# EasyEDA Pro project EasyEDApro.epro, board Robo-EM-ESP32C6-no-uart
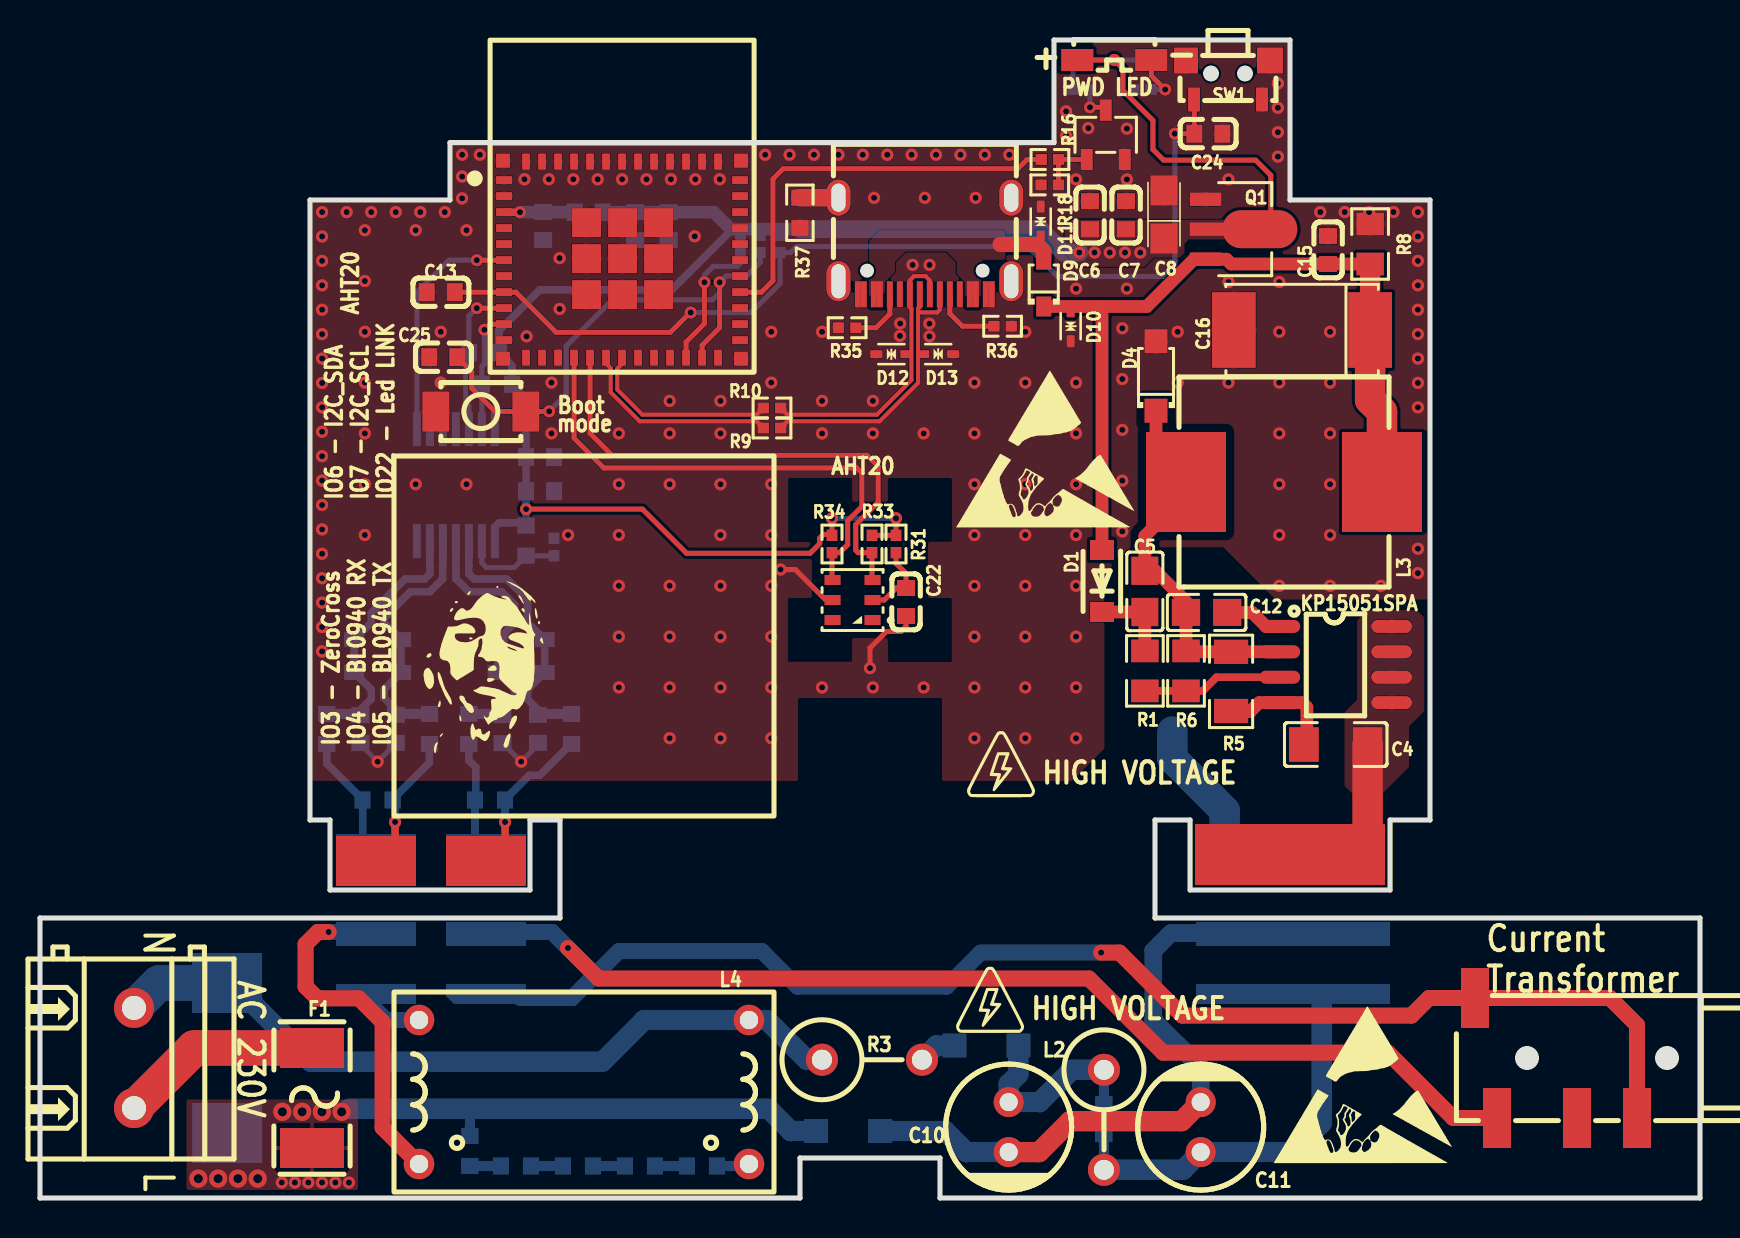
[diagram p1: board, top side]
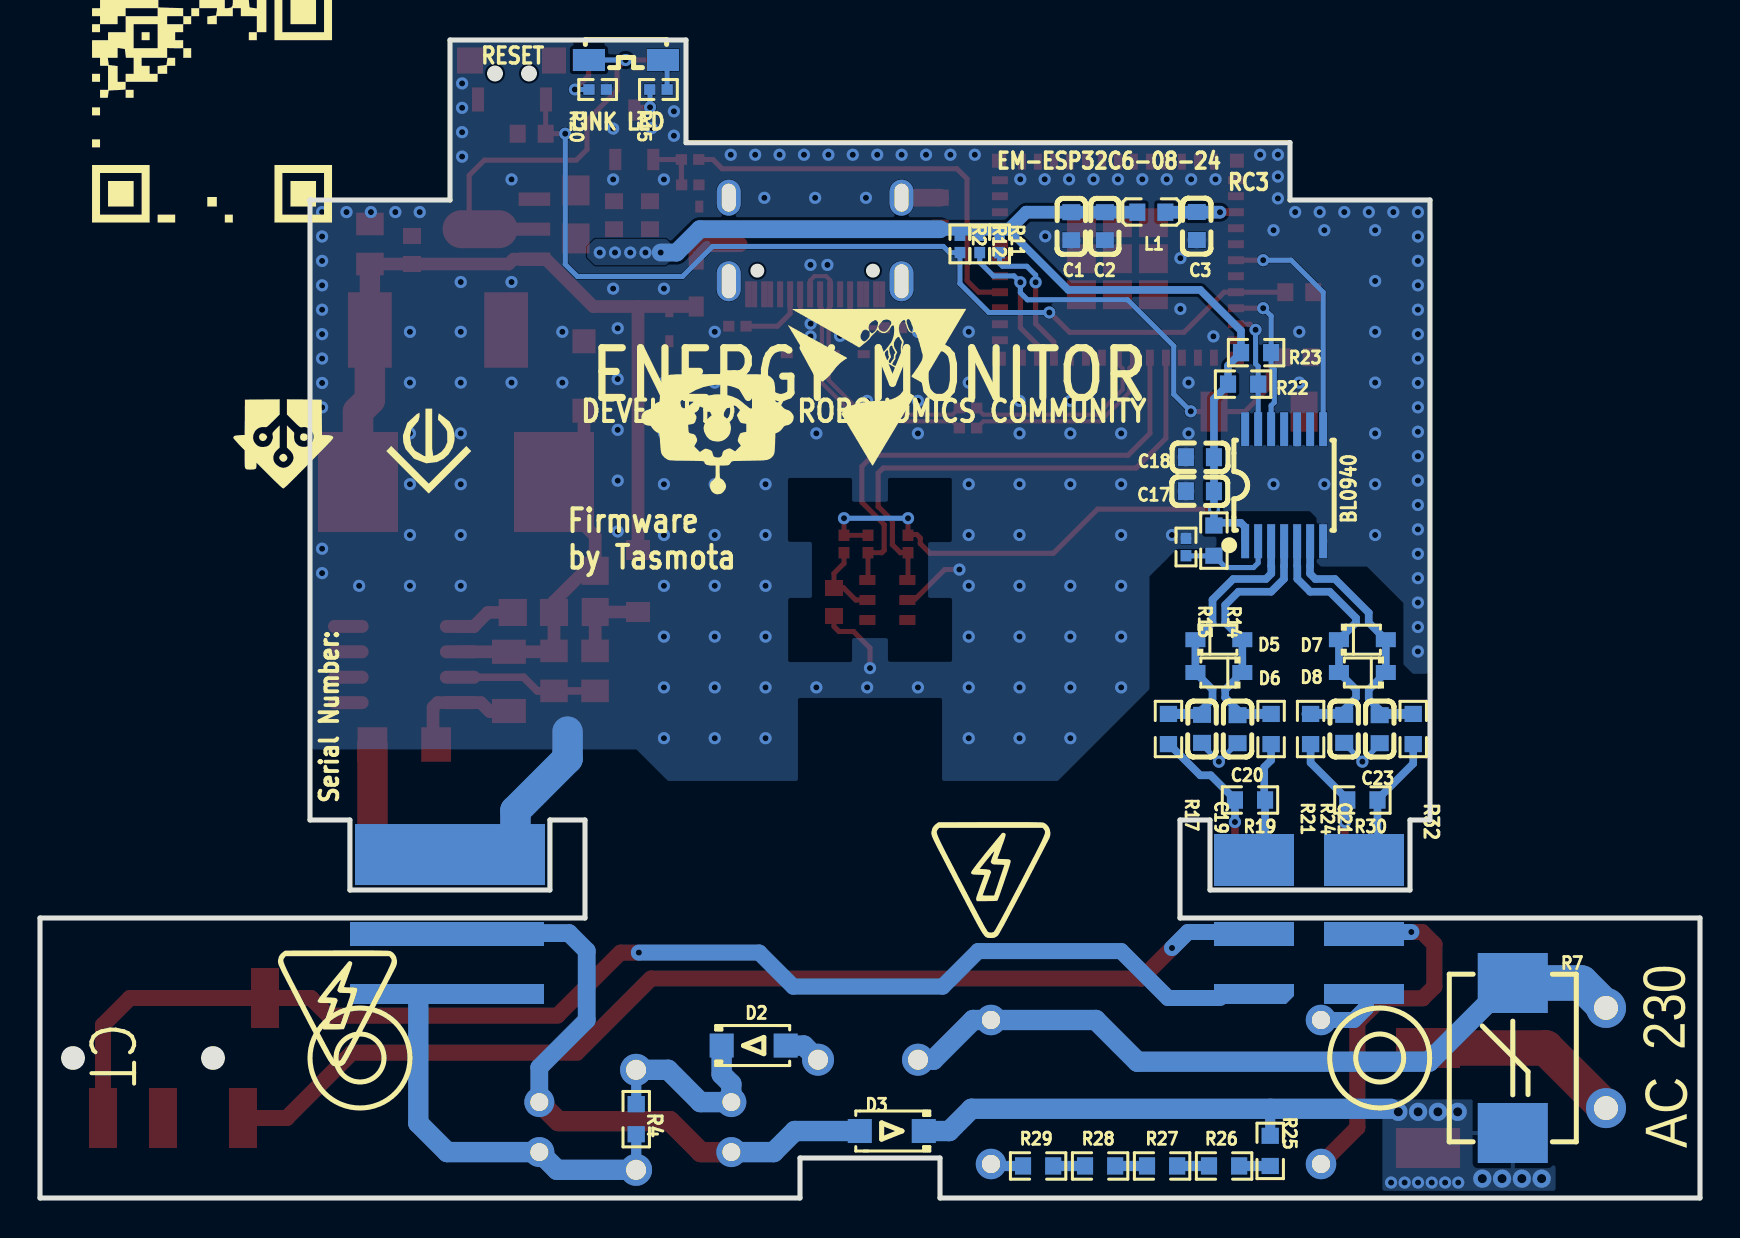
[diagram p2: board, bottom side, seen from below]

Outline 83 x 57.9 mm; copper layers: Top Layer, Bottom Layer. Coordinates in mm from the lower left corner of the outline.
Outline path: 0,14 26,14 26,18.9 24.5,18.9 24.5,15.4 14.5,15.4 14.5,18.9 13.5,18.9 13.5,49.9 20.5,49.9 20.5,52.77 50.7,52.77 50.7,57.9 62.5,57.9 62.5,49.9 69.5,49.9 69.5,18.9 67.5,18.9 67.5,15.4 57.5,15.4 57.5,18.9 55.75,18.9 55.75,14 83,14 83,0 45,0 45,2 38,2 38,0 0,0 0,14
Stack: Top Layer 0.035mm / Dielectric1 1.51mm FR4 er 4.5 / Bottom Layer 0.035mm

## Design rules (mm)
net USBDN: DP1
net USBDP: DP1
net IP1: DP_I
net IN1: DP_I
net VN: DP_V
net VP: DP_V
net EDN: DP2
net EDP: DP2
net IP2: DP_I1
net IN2: DP_I1
net VP1: DP_V1
net VN1: DP_V1
template: Custom Config
spacing copperThickness1oz (default): track to track 0.102, other pairs 0.152 to 0.3
spacing copperThickness2oz: track to track 0.203, other pairs 0.152 to 0.3
track width copperThickness1oz (default): min 0.127, default 0.254, max 2.54
track width copperThickness2oz: min 0.203, default 0.254, max 2.54
differential pair differentialPair (default): width min 0.127, default 0.254, max 2.54; gap min 0.152, default 0.152
differential pair differentialPair_USB: width min 0.208, default 0.208, max 0.208; gap min 0.127, default 0.127
differential pair differentialPair_EM: width min 0.381, default 0.381, max 2.54; gap min 0.254, default 0.254
via viaSize (default): diameter min 0.5, default 0.61, max 10; hole min 0.3, default 0.305, max 6.299
net GND uses copperRegion_USB
net VUSB uses copperRegion_VUSB
net USBDN uses copperRegion_USB, differentialPair_USB
net USBDP uses copperRegion_USB, differentialPair_USB
net +5V uses copperRegion_VUSB
net IP1 uses differentialPair_EM
net IN1 uses differentialPair_EM
net VN uses differentialPair_EM
net VP uses differentialPair_EM
net 3V3 uses copperRegion_VUSB
net $1N85419 uses copperRegion_VUSB
net EDN uses copperRegion_USB, differentialPair_USB
net EDP uses copperRegion_USB, differentialPair_USB
net IP2 uses differentialPair_EM
net IN2 uses differentialPair_EM
net VP1 uses differentialPair_EM
net VN1 uses differentialPair_EM
net PWM uses copperRegion_PWM
diff pair DP1 uses differentialPair_USB
diff pair DP_I uses differentialPair_EM
diff pair DP_V uses differentialPair_EM
diff pair DP2 uses differentialPair_USB
diff pair DP_I1 uses differentialPair_EM
diff pair DP_V1 uses differentialPair_EM
['net', 'edp'] ['NET', 'EDN'] uses copperRegion_USB
['net', 'usbdp'] ['NET', 'USBDN'] uses copperRegion_USB

## Placement (name value [footprint] x y rotation side)
C1  10uF  [C0603]  31.43 48.59 90 bottom
C2  100nF  [C0603]  29.76 48.59 90 bottom
C3  100nF  [C0603]  25.16 48.6 90 bottom
C4  100pF  [C1206]  64.79 22.67 0 top
C5  1uF  [C0805]  55.24 30.33 270 top
C6  22nF  [C0603]  52.5 49.14 270 top
C7  1uF  [C0603]  54.3 49.14 270 top
C8  22uF  [CASE-A_3216]  56.2 49.18 90 top
C10  2.2uF  [CAP-TH_BD6.3-P2.50-D0.5-FD]  48.43 3.55 270 top
C11  2.2uF  [CAP-TH_BD6.3-P2.50-D0.5-FD]  58.03 3.55 90 top
C12  1uF  [C0805]  58.33 29.28 0 top
C13  1uF  [C0603]  20.04 45.29 180 top
C15  10uF  [C0603]  64.4 47.4 270 top
C16  680uF  [CAP-SMD_L7.3-W4.3]  63.1 43.4 0 top
C17  10uF  [C0603]  25 35.34 180 bottom
C18  100nF  [C0603]  25 37.04 0 bottom
C19  33nF  [C0603]  24.9 23.46 90 bottom
C20  33nF  [C0603]  23.12 23.44 270 bottom
C21  33nF  [C0603]  17.79 23.46 90 bottom
C22  10uF  [C0603]  43.3 29.8 270 top
C23  33nF  [C0603]  16.02 23.44 270 bottom
C24  100nF  [C0603]  58.42 53.22 0 top
C25  100nF  [C0603]  20.16 42.04 180 top
CN1  PJ-320D  [AUDIO-SMD_PJ-320D]  75.8 7 270 top
D1  FR107W  [SOD-123F_L2.8-W1.8-LS3.7-RD]  53.1 30.85 90 top
D2  1N4007  [SOD-123FL_L2.8-W1.8-LS3.7-RD]  47.32 7.62 180 bottom
D3  1N4007  [SOD-123FL_L2.8-W1.8-LS3.7-RD]  40.41 3.35 0 bottom
D4  E1J  [SOD-123FL_L2.7-W1.8-LS3.7-RD]  55.8 41.1 90 top
D5  1N4148WS  [SOD-323_L1.8-W1.3-LS2.5-RD]  24.06 27.92 180 bottom
D6  1N4148WS  [SOD-323_L1.8-W1.3-LS2.5-RD]  24.06 26.28 0 bottom
D7  1N4148WS  [SOD-323_L1.8-W1.3-LS2.5-RD]  16.88 27.92 180 bottom
D8  1N4148WS  [SOD-323_L1.8-W1.3-LS2.5-RD]  16.88 26.28 0 bottom
D9  -  [SOD-323_L1.8-W1.3-LS2.5-RD]  50.19 45.75 90 top
D10  LESD5D5.0CT1G-ES  [SOD-523_L1.2-W0.8-LS1.6-BI]  51.53 43.59 90 top
D11  LESD5D5.0CT1G-ES  [SOD-523_L1.2-W0.8-LS1.6-BI]  50.03 48.82 270 top
D12  LESD5D5.0CT1G-ES  [SOD-523_L1.2-W0.8-LS1.6-BI]  42.57 42.19 0 top
D13  LESD5D5.0CT1G-ES  [SOD-523_L1.2-W0.8-LS1.6-BI]  44.91 42.19 180 top
F1  JFC2410-1200FS  [F2410]  13.6 5 90 top
L1  2nH  [L0603]  27.43 49.29 180 bottom
L2  220uH  [IND-TH_BD4.0-P5.00-D0.8]  53.2 3.91 270 top
L3  560uH  [IND-SMD_L10.5-W10.5]  62.2 35.8 0 top
L4  HPT225A-G  [XFMR-TH_4P-L19.0-10.0-P7.20]  27.2 5.3 180 top
LED1  XL-4008UGC  [LED-SMD_L4.0-W1.4-RD_GREEN]  53.7 56.9 0 bottom
NOREF  -  [Pad_e19800]  62.5 17.17 0 top
NOREF#2  -  [Pad_e19812]  62.65 13.2 0 top
NOREF#3  -  [Pad_e19813]  62.65 10.2 0 top
NOREF#4  -  [Pad_e19808]  16.8 13.2 0 top
NOREF#5  -  [Pad_e19809]  22.3 13.2 0 top
NOREF#6  -  [Pad_e19803]  16.8 16.9 0 top
NOREF#7  -  [Pad_e19810]  16.8 10.2 0 top
NOREF#8  -  [Pad_e19806]  16.8 16.85 0 top
NOREF#9  -  [Pad_e19802]  22.3 16.9 0 top
NOREF#10  -  [Pad_e19807]  22.3 16.85 0 top
NOREF#11  -  [Pad_e19811]  22.3 10.2 0 top
NOREF#12  -  [Pad_e19801]  62.5 17.17 0 top
P1  WJ128V-5.0-2P  [CONN-TH_2P-P5.00_WJ128V-5.0-2P]  4.7 7 270 top
Q1  AMS1117-3.3V  [SOT-89-3_L4.5-W2.5-P1.50-LS4.2-BR]  59.64 48.44 180 top
Q2  SS8050  [SOT-23-3_L2.9-W1.6-P1.90-LS2.8-BR]  53.29 53.16 270 top
R1  39kΩ  [R0805]  55.25 26.36 90 top
R2  10kΩ  [R0402]  37 47.7 90 bottom
R3  100Ω  [IND-TH_BD4.0-P5.00-D0.8]  41.6 6.91 0 top
R4  4.7kΩ  [R0603]  53.19 3.94 270 bottom
R5  510mΩ  [R1206]  59.55 25.83 90 top
R6  20kΩ  [R0805]  57.3 26.36 270 top
R7  07D471K68RV0149  [RES-SMD_L8.2-W6.3]  9.36 7 90 bottom
R8  10kΩ  [R0805]  66.51 47.7 270 top
R9  22Ω  [R0402]  36.6 38.5 180 top
R10  22Ω  [R0402]  36.6 39.5 180 top
R11  3.3kΩ  [R0402]  35.02 47.7 270 bottom
R12  10kΩ  [R0402]  36.01 47.7 90 bottom
R13  10kΩ  [R0402]  25.7 32.55 270 bottom
R14  CMFA103J3950HANT  [R0603]  24.3 32.87 90 bottom
R15  1kΩ  [R0402]  52.08 55.43 180 bottom
R16  1kΩ  [R0402]  50.5 51.92 0 top
R17  1kΩ  [R0603]  26.58 23.45 90 bottom
R18  10kΩ  [R0402]  50.49 50.65 0 top
R19  1Ω  [R0603]  22.5 19.9 0 bottom
R20  1kΩ  [R0402]  55.12 55.43 0 bottom
R21  1kΩ  [R0603]  21.44 23.45 90 bottom
R22  4.7kΩ  [R0603]  22.85 40.69 180 bottom
R23  4.7kΩ  [R0603]  22.2 42.27 180 bottom
R24  1kΩ  [R0603]  19.47 23.45 90 bottom
R25  20kΩ  [R0603]  21.49 2.35 270 bottom
R26  20kΩ  [R0603]  23.8 1.6 0 bottom
R27  20kΩ  [R0603]  26.9 1.6 0 bottom
R28  20kΩ  [R0603]  30 1.6 0 bottom
R29  20kΩ  [R0603]  33.09 1.6 0 bottom
R30  22Ω  [R0603]  16.88 19.9 0 bottom
R31  390Ω  [R0402]  42.8 32.7 270 top
R32  1kΩ  [R0603]  14.34 23.45 90 bottom
R33  4.7kΩ  [R0402]  41.6 32.7 270 top
R34  4.7kΩ  [R0402]  39.6 32.7 270 top
R35  5.1kΩ  [R0402]  40.36 43.51 0 top
R36  5.1kΩ  [R0402]  48.13 43.59 180 top
R37  1MΩ  [R0603]  38 49.26 90 top
SW1  TS-1010-C-A  [key-smd_tx-1010-x-x]  59.4 55.9 0 top
SW2  -  [SW-SMD_L3.9-W2.9-P4.15-LS5.0]  22.04 39.32 0 top
U1  ESP32-C6-MINI-1-N4  [WIFIM-SMD_61P-L16.6-W13.2-P0.80-ESP32-C6-MINI-1-N4]  29.1 46.92 0 top
U2  KP15051SPA  [SOP-8_L4.9-W3.8-P1.27-LS6.0-BL]  64.79 26.67 270 top
U3  BL0940  [TSSOP-14_L5.0-W4.4-P0.65-LS6.4-BL]  20.79 35.64 180 bottom
U4  XL-4008SURC  [LED-SMD_L4.0-W1.4-FD_C9900036310]  53.72 56.9 0 top
U5  AHT20  [SENSOR-SMD_L3.0-W3.0-P1.00-BR]  40.63 29.9 0 top
USB1  KH-TYPE-C-16P  [USB-C-SMD_KH-TYPE-C-16P]  44.24 47.6 180 top

## Footprints (pads in the part's own frame, mm; a bottom-side part is the same pattern mirrored in y, then rotated)
AUDIO-SMD_PJ-320D
  rect 3x1.4 smd: 1(-3,-4.05) 2(3,4.05) 3(3,1.05) 4(3,-2.95)
C0603
  rect 0.8x0.9 smd: 1(-0.7,0) 2(0.7,0)
C0805
  rect 1.41x1.35 smd: 1(-1.03,0) 2(1.03,0)
C1206
  rect 1.485x1.728 smd: 1(-1.593,0) 2(1.593,0)
CAP-SMD_L7.3-W4.3
  rect 2.185x3.78 smd: 1(3.406,0) 2(-3.406,0)
CAP-TH_BD6.3-P2.50-D0.5-FD
  round 1.5 hole 0.9: 1(-1.25,0) 2(1.25,0)
CASE-A_3216
  rect 1.5x1.359 smd: 1(-1.2,0) 2(1.2,0)
CONN-TH_2P-P5.00_WJ128V-5.0-2P
  round 2 hole 1.2: 1(-2.505,0) 2(2.505,0)
F2410
  rect 2x3.2 smd: 1(-2.5,0) 2(2.5,0)
IND-SMD_L10.5-W10.5
  rect 4x5 smd: 1(-4.9,0) 2(4.9,0)
IND-TH_BD4.0-P5.00-D0.8
  round 1.6 hole 1: 1(-2.5,0) 2(2.5,0)
key-smd_tx-1010-x-x
  rect 0.6x1.2 smd: 1(-1.7,-0.975) 2(1.7,-0.975)
  rect 1.2x1.3 smd: 3(-2.1,0.975)
  rect 1.3x1.3 smd: 4(2.1,0.975)
L0603
  rect 0.8x0.864 smd: 1(-0.7,0) 2(0.7,0)
LED-SMD_L4.0-W1.4-FD_C9900036310
  rect 1.6x1.1 smd: 1(-1.85,0) 2(1.85,0)
LED-SMD_L4.0-W1.4-RD_GREEN
  rect 1.6x1.1 smd: 1(-1.85,0) 2(1.85,0)
Pad_e19800
  rect 9.5x3.05 smd: 2(0,0)
Pad_e19801
  rect 9.5x3.05 smd far side: 2(0,0)
Pad_e19802
  rect 4x2.6 smd far side: 2(0,0)
Pad_e19803
  rect 4x2.6 smd far side: 2(0,0)
Pad_e19806
  rect 4x2.5 smd: 2(0,0)
Pad_e19807
  rect 4x2.5 smd: 2(0,0)
Pad_e19808
  rect 4x1.2 smd far side: 2(0,0)
Pad_e19809
  rect 4x1.2 smd far side: 2(0,0)
Pad_e19810
  rect 4x1 smd far side: 2(0,0)
Pad_e19811
  custom 4x1 smd far side: 54(0,0)
Pad_e19812
  rect 9.7x1.2 smd far side: 2(0,0)
Pad_e19813
  rect 9.7x1 smd far side: 2(0,0)
R0402
  rect 0.566x0.54 smd: 1(-0.433,0) 2(0.433,0)
R0603
  rect 0.806x0.864 smd: 1(-0.753,0) 2(0.753,0)
R0805
  rect 1.133x1.377 smd: 1(-1,0) 2(1,0)
R1206
  rect 1.208x1.701 smd: 1(-1.479,0) 2(1.479,0)
RES-SMD_L8.2-W6.3
  rect 3x3.5 smd: 1(-3.75,0) 2(3.75,0)
SENSOR-SMD_L3.0-W3.0-P1.00-BR
  rect 0.8x0.5 smd: 1(1,-1) 2(1,0) 3(1,1) 4(-1,1) 5(-1,0) 6(-1,-1)
SOD-123F_L2.8-W1.8-LS3.7-RD
  rect 1x1.2 smd: 1(-1.55,0) 2(1.55,0)
SOD-123FL_L2.7-W1.8-LS3.7-RD
  rect 1.2x1.15 smd: 1(-1.735,0) 2(1.735,0)
SOD-123FL_L2.8-W1.8-LS3.7-RD
  rect 1.2x1.2 smd: 1(-1.6,0) 2(1.6,0)
SOD-323_L1.8-W1.3-LS2.5-RD
  rect 1x0.75 smd: 1(-1.173,0) 2(1.173,0)
SOD-523_L1.2-W0.8-LS1.6-BI
  rect 0.6x0.4 smd: 1(-0.75,0) 2(0.75,0)
SOP-8_L4.9-W3.8-P1.27-LS6.0-BL
  oval 0.65x2.032 smd: 1(-1.905,-2.796) 2(-0.635,-2.796) 3(0.635,-2.796) 4(1.905,-2.796) 5(1.905,2.796) 6(0.635,2.796) 7(-0.635,2.796) 8(-1.905,2.796)
SOT-23-3_L2.9-W1.6-P1.90-LS2.8-BR
  rect 1.07x0.6 smd: 1(1.235,-0.95) 2(1.235,0.95) 3(-1.235,0)
SOT-89-3_L4.5-W2.5-P1.50-LS4.2-BR
  rect 1.575x0.672 smd: 1(1.356,-1.5) 3(1.356,1.5)
  custom 5.377x1.9 smd: 2(-1.356,0)
SW-SMD_L3.9-W2.9-P4.15-LS5.0
  rect 1.35x2 smd: 1(-2.25,0) 2(2.25,0)
TSSOP-14_L5.0-W4.4-P0.65-LS6.4-BL
  rect 0.4x1.7 smd: 1(-1.95,-2.8) 2(-1.3,-2.8) 3(-0.65,-2.8) 4(0,-2.8) 5(0.65,-2.8) 6(1.3,-2.8) 7(1.95,-2.8) 8(1.95,2.8) 9(1.3,2.8) 10(0.65,2.8) 11(0,2.8) 12(-0.65,2.8) 13(-1.3,2.8) 14(-1.95,2.8)
USB-C-SMD_KH-TYPE-C-16P
  oval 1.2x2 hole 0.7x1.7: 1(-4.32,1.765) 2(4.32,1.765)
  oval 1.2x1.8 hole 0.7x1.4: 3(-4.32,-2.415) 4(4.32,-2.415)
  rect 0.3x1.3 smd: A1(-3.35,2.415) A4(-2.55,2.415) A5(-1.25,2.415) A6(-0.25,2.415) A7(0.25,2.415) A8(1.25,2.415) A9(2.55,2.415) A12(3.35,2.415) B1(3.05,2.415) B4(2.25,2.415) B5(1.75,2.415) B6(0.75,2.415) B7(-0.75,2.415) B8(-1.75,2.415) B9(-2.25,2.415) B12(-3.05,2.415)
WIFIM-SMD_61P-L16.6-W13.2-P0.80-ESP32-C6-MINI-1-N4
  rect 0.8x0.4 smd: 1(-5.9,3.975) 2(-5.9,3.175) 3(-5.9,2.375) 4(-5.9,1.575) 5(-5.9,0.775) 6(-5.9,-0.025) 7(-5.9,-0.825) 8(-5.9,-1.625) 9(-5.9,-2.425) 10(-5.9,-3.225) 11(-5.9,-4.025) 25(5.9,-4.025) 26(5.9,-3.225) 27(5.9,-2.425) 28(5.9,-1.625) 29(5.9,-0.825) 30(5.9,-0.025) 31(5.9,0.775) 32(5.9,1.575) 33(5.9,2.375) 34(5.9,3.175) 35(5.9,3.975)
  rect 0.4x0.8 smd: 12(-4.8,-4.9) 13(-4,-4.9) 14(-3.2,-4.9) 15(-2.4,-4.9) 16(-1.6,-4.9) 17(-0.8,-4.9) 18(0,-4.9) 19(0.8,-4.9) 20(1.6,-4.9) 21(2.4,-4.9) 22(3.2,-4.9) 23(4,-4.9) 24(4.8,-4.9) 36(4.8,4.9) 37(4,4.9) 38(3.2,4.9) 39(2.4,4.9) 40(1.6,4.9) 41(0.8,4.9) 42(0,4.9) 43(-0.8,4.9) 44(-1.6,4.9) 45(-2.4,4.9) 46(-3.2,4.9) 47(-4,4.9) 48(-4.8,4.9)
  rect 1.45x1.45 smd: 49(-1.775,1.85) 49(-1.775,0.05) 49(-1.775,-1.75) 49(0.025,1.85) 49(0.025,0.05) 49(0.025,-1.75) 49(1.825,1.85) 49(1.825,0.05) 49(1.825,-1.75)
  rect 0.7x0.7 smd: 50(5.95,4.95) 51(5.95,-4.95) 52(-5.95,-4.95) 53(-5.95,4.95)
XFMR-TH_4P-L19.0-10.0-P7.20
  round 1.524 hole 0.914: 1(-8.25,3.6) 2(-8.25,-3.6) 3(8.25,3.6) 4(8.25,-3.6)

## Nets
As in the schematic, except:
GND: C1.1 C2.1 C3.1 C6.1 C7.1 C8.2 C10.2 C11.2 C13.2 C15.1 C16.2 C17.1 C18.2 C19.1 C20.2 C21.1 C22.2 C23.2 C24.2 C25.2 D3.2 D4.2 D10.1 D11.1 D12.1 D13.1 NOREF#2.2 NOREF#12.2 Q1.1 Q2.2 R8.1 R13.1 R18.1 R20.1 R35.1 R36.1 R37.1 SW1.2 SW1.3 SW1.4 SW2.1 U1.1 U1.2 U1.11 U1.14 U1.36 U1.37 U1.38 U1.39 U1.40 U1.41 U1.42 U1.43 U1.44 U1.45 U1.46 U1.47 U1.48 U1.49 U1.50 U1.51 U1.52 U1.53 U3.7 U3.10 U5.5 USB1.A1 USB1.A12 USB1.B1 USB1.B12
DRAIN: C4.2 C11.1 L2.2 NOREF.2 NOREF#3.2 R4.2 U2.5 U2.6 U2.7 U2.8
IN1: CN1.4 NOREF#5.2 NOREF#9.2 R19.1 R21.1
IP1: CN1.1 CN1.2 NOREF#10.2 NOREF#11.54 R17.1 R19.2
VN: L4.3 NOREF#4.2 NOREF#6.2 R30.1 R32.1
VP: L4.4 NOREF#7.2 NOREF#8.2 R24.1 R30.2

Pads without a net: CN1 3; U1 4 5 7 13 19 20 21 24 25 26 27 29 32 33 34 35; U3 11 14; U5 1 6; USB1 A8 B8

## Via types
v1: diameter 0.61, hole 0.305, Top Layer to Bottom Layer, 226 vias
v2: diameter 0.914, hole 0.457, Top Layer to Bottom Layer, 8 vias

## Routing (per net, layer and track width the routed paths; a pad name or vN(x,y) marks a point on that pad's centre or on a via; arc(x,y) is an arc through that point)
3V3: length 92.3
  Top Layer w0.254: v1(24.3,34.45) 30.12,34.45 32.33,32.23 38.5,32.23 38.99,32.72 38.99,33 39.16,33.18 39.56,33.18 R34.1 v1(39.6,33.99) ; Q1.2 61.54,48.99 61.54,51.13 60.78,51.89 56.18,51.89 55.65,52.43 55.65,53.88 54.15,55.37 54.15,56.47 v1(53.72,56.9) U4.1 ; v1(42.8,33.99) R31.1 R33.1
  Bottom Layer w0.254: v1(53.72,56.9) LED1.2 ; v1(39.6,33.99) v1(42.8,33.99)
  Bottom Layer w0.381: U3.1 22.74,33.54 22.96,33.76 24.17,33.76 R14.2 v1(24.3,34.45) C17.2 C18.1 24.3,39.96 23.6,40.66 R22.1 23.6,41.62 R23.1 22.95,43.37 24.99,45.41 31.58,45.41 34.54,48.36 34.54,48.44
  Bottom Layer w0.635: L1.1 C2.2 C1.2 33.69,49.29 34.54,48.44 38,48.44
  Bottom Layer w0.889: v1(51.97,47.27) 51.18,47.27 50.01,48.44 38,48.44
  vias: v1(52.73,47.27) v1(53.49,47.27) v1(54.25,47.27) v1(55.01,47.27)
+5V: length 40.7
  Top Layer w0.635: 53.07,44.58 53.1,44.55 53.1,32.42 ; 53.07,44.58 55.34,44.58 57.7,46.94 Q1.3 59.32,46.94 59.56,46.7 C15.2 R8.2 ; 53.07,44.58 D9.1
  Top Layer w1.016: C16.1 R8.2
  Top Layer w1.524: C16.1 66.51,39.91 67.1,39.32 L3.2
GND: length 48.5
  Top Layer w0.254: U5.5 39.58,29.95 39.24,29.95 37.77,31.42 v1(37.03,31.42) ; C22.2 43.3,28.57 43.05,28.33 42.32,28.33 41.5,27.5 v1(41.5,26.49)
  Top Layer w1.016: C11.2 57.08,3.84 51.5,3.84 49.96,2.3 C10.2
  Bottom Layer w0.254: C23.2 16.02,22.68 v1(16.88,21.82) 17.79,22.73 C21.1 ; C20.2 23.13,22.74 v1(24.06,21.82) 24.9,22.66 C19.1
  Bottom Layer w0.889: 58.34,13.24 56.55,13.24 55.67,12.36 55.67,8.9 58.03,6.53 C11.2
  Bottom Layer w1.016: C10.2 46.32,2.3 45.26,3.35 D3.2
  Bottom Layer w1.524: 56.62,23.32 56.62,21.97 59.23,19.37 59.23,17.22
  vias: v1(14.1,49.3) v1(14.1,48.08) v1(14.1,46.85) v1(14.1,45.63) v1(14.1,44.41) v1(14.1,43.19) v1(14.1,41.97) v1(14.1,40.75) v1(14.1,39.53) v1(14.1,38.31) v1(14.1,37.09) v1(14.1,35.87) v1(14.1,34.65) v1(14.1,33.43) v1(14.1,32.21) v1(14.1,30.99) v1(14.1,29.77) v1(14.1,28.55) v1(14.1,27.33) v1(15.33,49.3) v1(16.24,48.39) v1(16.24,45.85) v1(16.24,43.31) v1(16.24,40.77) v1(16.24,38.23) v1(16.24,35.69) v1(16.24,33.15) v1(16.56,49.3) v1(17.79,49.3) v1(18.78,48.39) v1(18.78,35.69) v1(19.01,49.3) v1(20.04,43.31) v1(20.04,40.77) v1(20.24,49.3) v1(21.1,52.16) v1(21.1,51.07) v1(21.1,49.98) v1(21.32,48.39) v1(21.32,35.69) v1(21.99,52.16) v1(24.22,50.94) v1(24.33,43.08) v1(25.44,50.94) v1(25.57,40.77) v1(25.57,38.23) v1(25.98,46.99) v1(25.98,44.45) v1(26.4,33.15) v1(26.66,50.94) v1(27.88,50.94) v1(28.94,38.23) v1(28.94,35.69) v1(28.94,33.15) v1(28.94,30.61) v1(28.94,28.07) v1(28.94,25.53) v1(29.1,50.94) v1(30.32,50.94) v1(31.55,50.94) v1(31.48,39.86) v1(31.48,38.23) v1(31.48,35.69) v1(31.48,30.61) v1(31.48,28.07) v1(31.48,25.53) v1(31.48,22.99) v1(32.74,48.08) v1(32.77,50.94) v1(33.99,50.94) v1(34.02,39.86) v1(34.02,38.23) v1(34.02,35.69) v1(34.02,33.15) v1(34.02,30.61) v1(34.02,28.07) v1(34.02,25.53) v1(34.02,22.99) v1(36.26,52.16) v1(36.56,43.31) v1(36.56,40.77) v1(36.56,35.69) v1(36.56,33.15) v1(36.56,30.61) v1(36.56,28.07) v1(36.56,25.53) v1(36.56,22.99) v1(37.48,52.16) v1(38.7,52.16) v1(39.1,43.31) v1(39.1,39.86) v1(39.1,38.23) v1(39.1,25.53) v1(39.92,52.16) v1(41.14,52.16) v1(41.64,39.86) v1(41.64,38.23) v1(41.64,25.53) v1(41.7,50.01) v1(42.36,52.16) v1(43.01,43.73) v1(43,43.11) v1(43.58,52.16) v1(43.63,46.66) v1(44.24,50.01) v1(44.18,38.23) v1(44.18,25.53) v1(44.48,46.66) v1(44.47,43.72) v1(44.47,43.08) v1(44.8,52.16) v1(46.02,52.16) v1(46.72,40.77) v1(46.72,38.23) v1(46.72,35.69) v1(46.72,33.15) v1(46.72,30.61) v1(46.72,28.07) v1(46.72,25.53) v1(46.72,22.99) v1(46.78,50.01) v1(47.24,52.16) v1(48.46,52.16) v1(49.26,43.31) v1(49.26,40.77) v1(49.26,38.23) v1(49.26,35.69) v1(49.26,33.15) v1(49.26,30.61) v1(49.26,28.07) v1(49.26,25.53) v1(49.26,22.99) v1(51.3,54.33) v1(51.3,53.11) v1(51.8,50.93) v1(51.8,45.47) v1(51.8,40.77) v1(51.8,38.23) v1(51.8,35.69) v1(51.8,33.15) v1(51.8,30.61) v1(51.8,28.07) v1(51.8,25.53) v1(51.8,22.99) v1(52.41,53.5) v1(54.11,43.49) v1(54.11,40.95) v1(54.11,38.41) v1(54.11,35.87) v1(54.11,33.33) v1(54.34,53.47) v1(54.34,50.93) v1(54.34,45.47) v1(56.88,43.31) v1(56.88,40.77) v1(59.42,50.93) v1(59.42,45.8) v1(59.42,40.77) v1(61.9,55.73) v1(61.9,54.51) v1(61.9,53.29) v1(61.9,52.07) v1(61.96,45.8) v1(61.96,43.31) v1(61.96,40.77) v1(61.96,38.23) v1(61.96,35.69) v1(61.96,33.15) v1(61.96,30.61) v1(64.01,49.3) v1(64.5,43.31) v1(64.5,40.77) v1(64.5,38.23) v1(64.5,35.69) v1(64.5,33.15) v1(64.5,30.61) v1(65.23,49.3) v1(66.45,49.3) v1(67.04,30.61) v1(67.68,49.3) v1(68.9,49.3) v1(68.9,48.08) v1(68.9,46.85) v1(68.9,45.63) v1(68.9,44.41) v1(68.9,43.19) v1(68.9,41.97) v1(68.9,40.75) v1(68.9,39.53) v1(68.9,32.46) v1(68.9,31.24)
BL0940_RX: length 7.7
  Top Layer w0.254: v1(21.84,44.49) U1.9
  Bottom Layer w0.254: U3.12 21.44,39.62 21.28,39.78 21.28,41.42 21.44,41.58 R23.2 21.44,44.11 21.83,44.49 v1(21.84,44.49)
BL0940_TX: length 6.1
  Top Layer w0.254: U1.10 22.5,43.69 v1(22.22,43.41)
  Bottom Layer w0.254: v1(22.22,43.41) 22.22,41.71 22.09,41.58 R22.2 U3.13
CC1: length 3
  Top Layer w0.254: 42.49,45.19 42.49,44.2 41.81,43.51 R35.2
CC2: length 3.4
  Top Layer w0.254: 45.49,45.19 45.49,44.22 46.12,43.59 R36.2
CS: length 6
  Top Layer w0.635: C4.1 63.34,22.82 63.34,24.54 63.11,24.77 U2.4 60.96,24.77 60.51,24.32 59.55,24.32
DRAIN: length 24.9
  Top Layer w1.524: C4.2 66.38,17.44 66.34,17.4
  Bottom Layer w0.508: L2.2 53.19,1.42 R4.2
  Bottom Layer w1.016: 64.09,9.69 64.09,3.74 62.64,2.3 C11.1 57.15,1.41 L2.2
EDN: length 10.2
  Top Layer w0.208: R9.2 35.84,38.83 29.98,38.83 28.53,40.28 28.53,41.5 28.3,41.73 28.3,42.03
EDP: length 9.7
  Top Layer w0.208: R10.2 35.84,39.17 30.12,39.17 28.87,40.42 28.87,41.47 29.1,41.7 29.1,42.03
ESP_EN: length 49.6
  Top Layer w0.254: SW1.1 57.72,54.91 C24.1 v1(56.74,53.22) ; v1(32.53,44.27) 32.51,44.27 31.52,43.28 25.8,43.28 23.8,45.29 U1.8 C13.1
  Bottom Layer w0.254: v1(32.53,44.27) 35.56,44.27 37,45.72 37,47.27 37.53,47.27 37.83,47.58 49.37,47.58 50.87,46.08 56.13,46.08 56.74,46.69 v1(56.74,53.22)
ESP_IO9: length 26.2
  Top Layer w0.254: C25.1 21.59,41.32 21.59,40.49 22.75,39.32 SW2.2 25.45,39.32 v1(25.46,39.33) ; U1.23 33.1,42.64 33.98,43.51 v1(33.98,45.79)
  Bottom Layer w0.254: v1(25.46,39.33) 26.31,40.19 26.31,42.6 28.62,44.91 33.63,44.91 33.98,45.27 v1(33.98,45.79) 34.3,46.1 35.33,46.1 36.01,46.79 36.01,47.27
FB: length 7
  Top Layer w0.381: U2.3 58.82,26.04 58.14,25.36 R6.2 R1.1
IN1: length 60.2
  Top Layer w0.8: v1(26.4,12.5) 27.93,10.98 52.45,10.98 56.16,7.27 67.4,7.27 70.66,4 CN1.4
  Bottom Layer w0.381: R21.1 21.44,21.89 21.79,21.54 21.79,19.94 R19.1 21.75,17.25
  Bottom Layer w0.8: v1(26.4,12.5) 25.6,13.3 22.1,13.3
IN2: length 13.5
  Bottom Layer w0.381: U3.4 20.79,31.61 20.8,31.6 20.8,30.96 21.44,30.31 23.07,30.31 23.74,29.65 23.74,28.77 D5.2 D6.1 23.74,25.42 23.74,25.02 23.12,24.4 C20.1
  Bottom Layer w0.5: C20.1 23.06,24.2 R21.2
IP1: length 72.6
  Top Layer w0.381: 23.24,16.92 23.25,16.94 v1(23.25,18.8)
  Top Layer w0.8: CN1.2 79.85,8.65 78.5,10 CN1.1 69.45,10 68.57,9.12 57.12,9.12 53.97,12.27 v1(53.06,12.27)
  Bottom Layer w0.381: R17.1 26.55,22.7 24.99,21.14 24.46,21.14 23.25,19.93 R19.2 v1(23.25,18.8)
  Bottom Layer w0.8: 24,10 26.6,10 28.95,12.35 36.09,12.35 37.87,10.57 45.34,10.57 47.04,12.27 v1(53.06,12.27)
IP2: length 13.5
  Bottom Layer w0.254: 24.94,24.2 C19.2
  Bottom Layer w0.381: C19.2 24.9,24.42 24.37,24.94 24.37,25.42 D6.2 D5.1 24.37,28.77 24.37,29.91 23.34,30.95 21.7,30.95 21.44,31.22 21.44,31.6 21.44,31.61 U3.3
  Bottom Layer w0.5: R17.2 24.94,24.2
L: length 25.2
  Bottom Layer w0.508: R25.1 21.49,4.46
  Bottom Layer w1.016: D3.1 37.54,3.35 36.43,4.46 15.46,4.46
  vias: v1(12.09,0.77) v1(12.74,0.77) v1(13.41,0.77) v1(14.1,0.77) v1(14.77,0.77) v1(15.45,0.77) v2(7.92,0.97) v2(8.91,0.97) v2(9.9,0.97) v2(10.89,0.97) v2(12.12,4.31) v2(13.11,4.31) v2(14.09,4.31) v2(15.08,4.31)
L_IN: length 10.1
  Top Layer w1.778: F1.2 7.71,7.5 4.71,4.5 P1.2
LED_LINK: length 20.8
  Top Layer w0.254: U1.28 36.07,45.29 36.65,45.87 36.65,50.96 37.16,51.46 48.89,51.46 49.35,51.92 R16.1
N_IN: length 38.2
  Bottom Layer w1.016: R3.1 38.33,6.91 36.34,8.9 L4.2 30.21,8.9 28.13,6.81 13.55,6.81 9.61,10.75 R7.2
  Bottom Layer w1.778: P1.1 5.95,10.75 R7.2
PWM: length 19.4
  Top Layer w0.635: D4.1 55.8,38.03 57.3,36.53 L3.1 57.3,35.16 55.24,33.1 C5.1 55.76,31.36 57.3,29.82 C12.1 R6.1 57.35,27.31 R5.2 U2.2
SCL: length 25.8
  Top Layer w0.254: U1.16 27.5,38.23 28.6,37.14 41.35,37.14 41.91,36.58 41.91,34.79 40.79,33.67 40.79,32.39 40.91,32.27 41.6,32.27 41.6,30.93 U5.3
SDA: length 25.3
  Top Layer w0.254: U5.4 39.6,30.93 39.6,32.27 39.98,32.27 40.38,32.67 40.38,33.86 41.09,34.57 41.09,36.25 40.84,36.5 28.19,36.5 26.71,37.99 U1.15
SHIELD: length 1.9
  Top Layer w0.889: R37.2 USB1.4
USBDN: length 14.2
  Top Layer w0.208: R9.1 37.37,38.83 41.98,38.83 43.91,40.76 43.91,44.26 ; 43.91,44.26 43.91,44.47 43.99,44.55 43.99,45.19 ; 43.91,44.26 43.92,44.28 44.86,44.28 44.99,44.41 44.99,45.19
USBDP: length 14.3
  Top Layer w0.208: R10.1 37.37,39.17 41.84,39.17 43.57,40.9 43.57,44.46 43.49,44.55 43.49,45.88 43.7,46.09 44.28,46.09 44.49,45.89 44.49,45.19
VN: length 24.2
  Top Layer w0.8: L4.3 17.13,3.52 17.13,8.8 15.94,9.98 13.86,9.98 13.28,10.57 13.28,12.69 13.89,13.3 v1(14.43,13.3)
  Bottom Layer w0.381: R32.1 14.34,21.72 16.13,19.93 R30.1 16.13,17.15 16.05,17.07
  Bottom Layer w0.8: v1(14.43,13.3) 16.3,13.3
VN1: length 12.9
  Bottom Layer w0.203: 15.96,24.2 C23.1
  Bottom Layer w0.381: 15.71,27.91 D8.1 16.56,25.42 16.56,24.95 16.02,24.4 C23.1 ; U3.6 19.49,31.61 19.5,31.6 19.5,31.22 19.23,30.95 18.25,30.95 16.56,29.26 16.56,28.77 D7.2
  Bottom Layer w0.5: 14.54,24.2 15.96,24.2
VP: length 9.3
  Top Layer w0.381: v1(17.75,18.8) 17.75,17.2
  Bottom Layer w0.381: v1(17.75,18.8) 17.75,19.78 R30.2 17.63,19.93 19.47,21.77 R24.1
  Bottom Layer w0.8: 16.7,10 16.7,9.5 17.3,8.9 L4.4
VP1: length 13.1
  Bottom Layer w0.254: 17.99,24.16 18.04,24.2
  Bottom Layer w0.381: U3.5 20.14,31.61 20.13,31.6 20.13,30.96 19.49,30.31 18.52,30.31 17.2,29 17.2,28.77 D7.1 D8.2 17.2,25.42 17.2,25.01 17.79,24.42 C21.2
  Bottom Layer w0.5: 18.04,24.2 19.67,24.2
VUSB: length 2.7
  Top Layer w0.762: 48,47.68 49.86,47.68 50.19,47.35 D9.2
ZCD: length 11.8
  Top Layer w0.254: U1.6 21.94,46.89
  Bottom Layer w0.254: U3.8 18.84,45.29 20.44,46.89 v1(21.84,46.89)
$1N2408: length 5
  Bottom Layer w0.254: U3.2 22.09,31.75 22.32,31.52 23.71,31.52 R14.1 24.31,32.11 25.7,32.11
$1N6046: length 2.7
  Top Layer w0.254: Q2.1 R16.2 50.93,50.66 R18.2
$1N10199: length 1.6
  Bottom Layer w0.508: R28.2 R29.1
$1N10201: length 1.6
  Bottom Layer w0.508: 27.65,1.6 R28.1
$1N10203: length 1.6
  Bottom Layer w0.508: R26.2 R27.1
$1N10205: length 1.6
  Bottom Layer w0.508: R25.2 R26.1
$1N34811: length 1.6
  Bottom Layer w0.508: R29.2 35.35,1.6 L4.1
$1N85397: length 7.1
  Top Layer w0.254: U1.22 32.31,42.8 33.22,43.72 v1(33.22,45.79)
  Bottom Layer w0.254: v1(33.22,45.79) 33.22,46.14 33.66,46.59 34.87,46.59 35.02,46.74 35.02,47.27
$1N85419: length 3.5
  Top Layer w0.381: v1(24,49.29) U1.3
  Bottom Layer w0.635: v1(24,49.29) 25.15,49.29 C3.2 25.17,49.29 26.73,49.29
$1N86448: length 4.1
  Top Layer w0.635: R1.2 55.24,27.36 C5.2 D1.1
$1N86450: length 2.9
  Top Layer w0.635: C12.2 60.6,29.28 61.3,28.58 U2.1
$1N94058: length 3.9
  Top Layer w0.254: 42.8,32.27 42.8,31.73 43.3,31.23 C22.1 43.29,30.51 42.82,30.51 42.21,29.9 U5.2
$1N94503: length 1.9
  Bottom Layer w1.016: R3.2 44.81,7.62 D2.2
$1N94519: length 10.2
  Bottom Layer w0.508: L2.1 53.19,6.4 R4.1
  Bottom Layer w1.016: L2.1 51.59,6.41 49.98,4.8 C10.1 48.43,5.7 48.92,6.19 D2.1
$1N99608: length 2.5
  Top Layer w0.254: U4.2 55.57,56.12 v1(56.26,55.43)
  Bottom Layer w0.254: v1(56.26,55.43) R20.2
$1N99610: length 1.7
  Top Layer w0.254: v1(52.5,54.54) 53.14,54.54 Q2.3
  Bottom Layer w0.254: v1(52.5,54.54) 52.5,55.41 R15.1
$1N99612: length 1.6
  Bottom Layer w0.254: 51.65,55.43 51.65,56.7 LED1.1

## Copper pours and planes (outline as drawn; the poured copper is in the pictures)
3V3 on Top Layer: 51.97,46.66 51.33,47.3 51.33,48.54 51.6,48.81 59.19,48.81 59.23,48.77 59.23,48.08 59.18,48.03 57.4,48.03 57.12,47.75 57.12,47.29 56.95,47.12 55.65,47.12 55.19,46.66
3V3 on Bottom Layer: 51.51,47.63 51.74,47.86 55.21,47.86 55.55,47.52 55.55,47.07 55.22,46.74 51.75,46.74 51.51,46.98
GND on Top Layer: 9.95,59.87 67.69,59.87 72.59,54.97 72.59,33.23 69.39,30.03 61.82,30.03 59.2,32.64 54.5,32.64 53.12,31.26 53.12,22.52 51.56,20.96 12.85,20.96 11.73,22.08 11.73,52.02 9.67,54.08 9.67,59.59
GND on Bottom Layer: 27.63,25.48 27.63,31.12 26.2,32.55 24.35,32.55 24.28,32.62 24.28,34.13 23.97,34.44 19.47,34.44 19.07,34.04 19.07,31.83 18.92,31.68 16.61,31.68 14.73,29.8 14.73,26.72 14.32,26.32 11.66,26.32 11.63,26.29 11.63,59.11 71.04,59.11 71.14,59.21 71.14,23.85 69.82,22.53 53.13,22.53 51.56,20.96 32.15,20.96
DRAIN on Top Layer: 65.32,24.23 65.96,24.87 65.96,28.83 66.42,29.29 68.81,29.29 69.11,28.98 69.11,24.39 68.35,23.62 68.35,21.59 67.1,20.35 65.63,20.35 65.32,20.65
L on Top Layer: 7.32,4.93 15.9,4.93 15.9,0.4 7.32,0.4
L on Bottom Layer: 7.22,4.93 15.88,4.93 15.88,0.36 7.22,0.36
VUSB on Top Layer: 41.55,45.34 42.15,45.34 42.15,45.84 42.65,46.34 42.65,46.85 43.23,47.42 45.37,47.42 45.94,46.85 45.94,46.24 46.35,45.84 46.35,45.19 46.94,45.19 46.94,46.83 47.12,47.01 48.16,47.01 48.16,48.29 42.04,48.29 41.55,47.8

Small or netless copper shapes (teardrops, artwork), in the pictures only: 1 on Top Layer

## Text on the board
Bottom Silkscreen Layer: BL0940 | RC3 | EM-ESP32C6-08-24 | LINK LED | RESET | Serial Number: | DEVELOPED BY ROBONOMICS COMMUNITY | Firmware / by Tasmota | CT | ENERGY MONITOR | AC | 230
Top Silkscreen Layer: KP15051SPA | PWD LED | IO3 - ZeroCross / IO4 - BL0940 RX / IO5 - BL0940 TX | IO6 - I2C_SDA / IO7 - I2C_SCL / IO22 - Led LINK | mode | Boot | AHT20 | HIGH VOLTAGE | Current / Transformer | AC 230V | N | L
